# EAGLE design CUSTOMIZED UN0O BOARD (EAGLE 9.6.2)

## Sheet 1 of 2
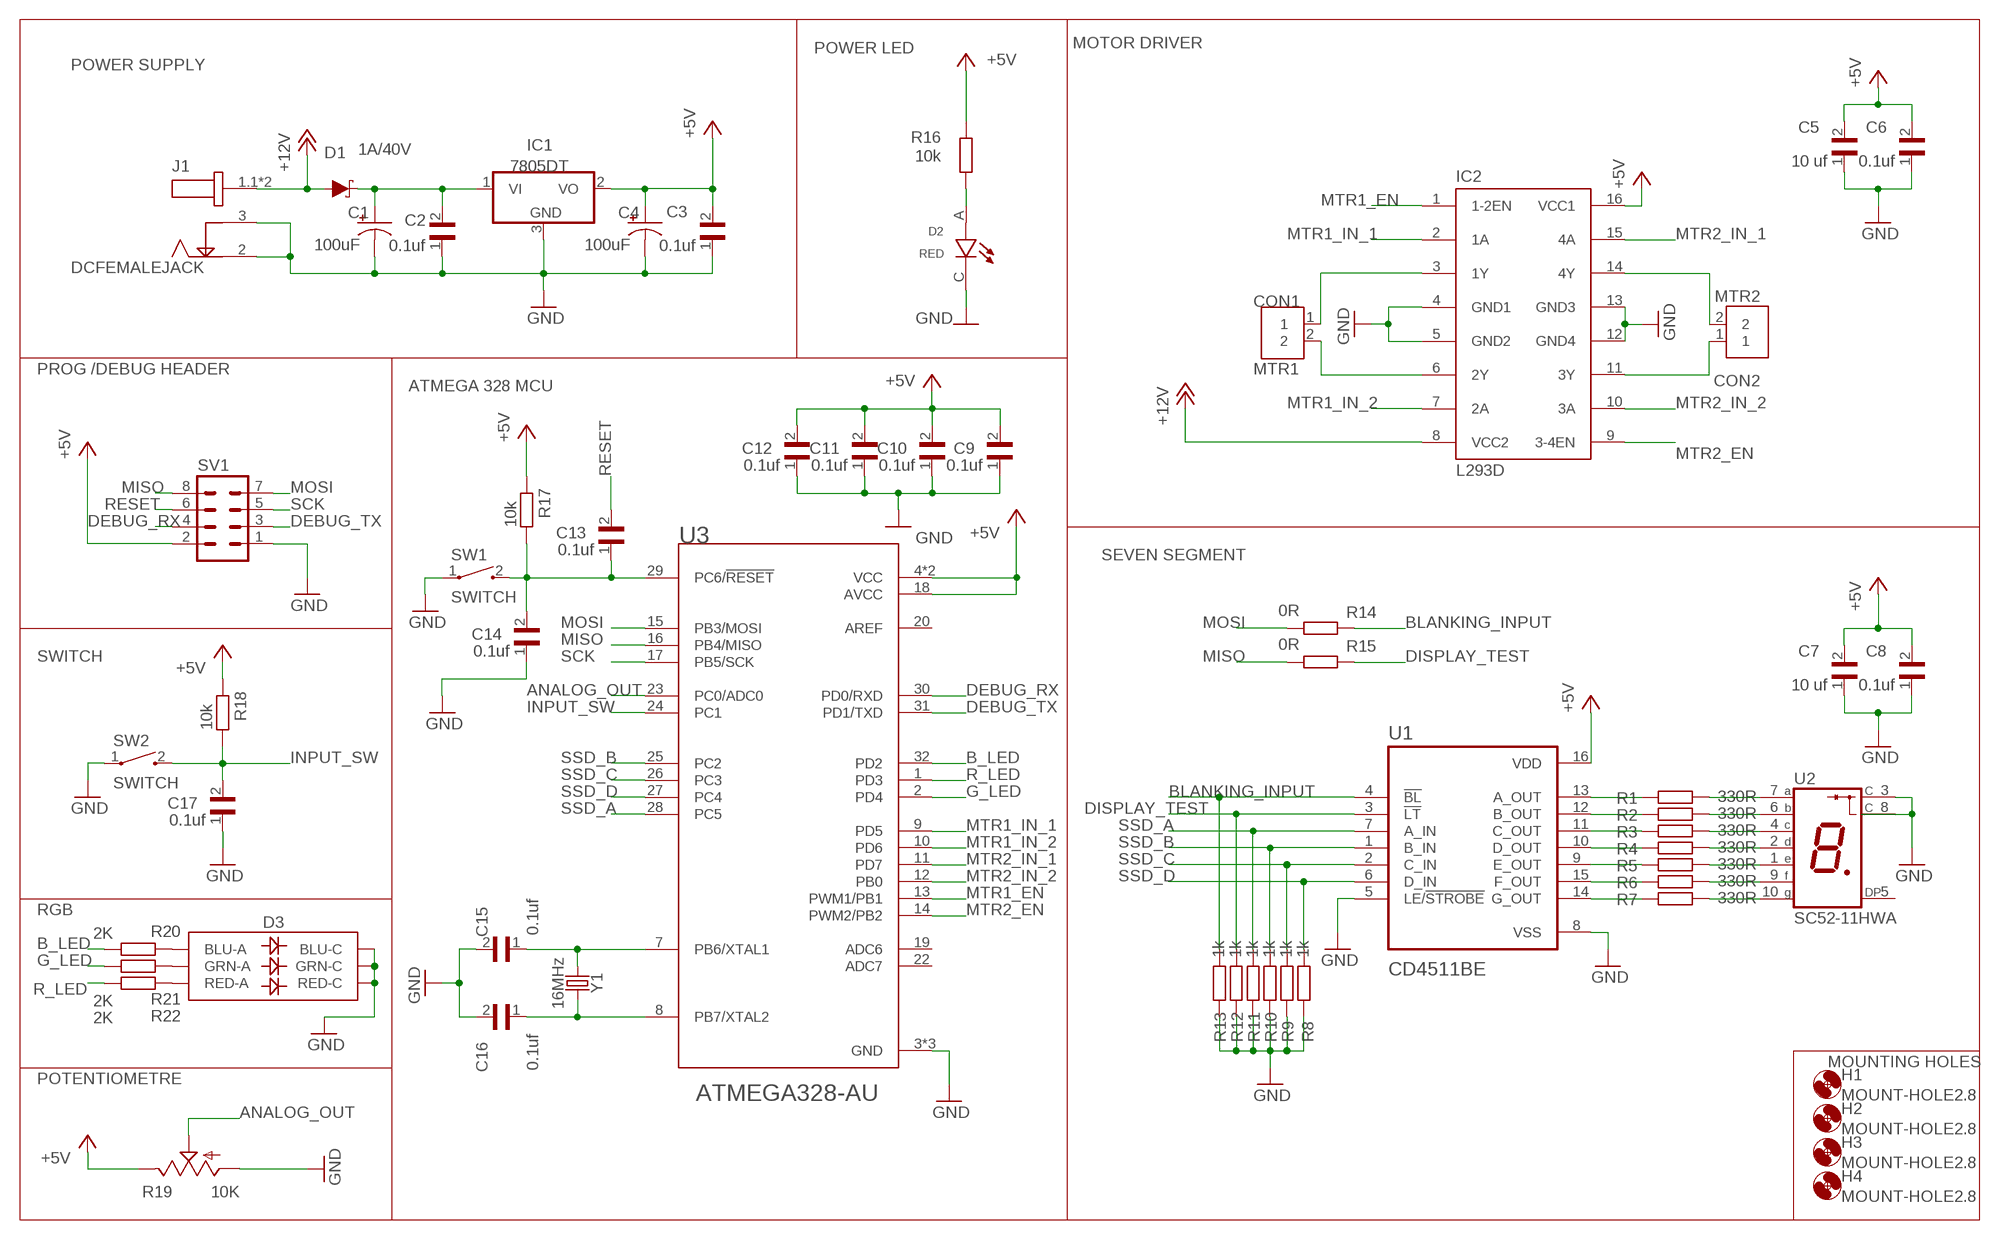
[diagram p0: schematic, sheet 1]

### Parts
C1  100uF  100UF-POLAR-RADIAL-2.5MM-25V-20%  [CPOL-RADIAL-2.5MM-6.5MM]
C2  CAPACITOR  [C0603]
C3  CAPACITOR  [C0603]
C4  100uF  100UF-POLAR-RADIAL-2.5MM-25V-20%  [CPOL-RADIAL-2.5MM-6.5MM]
C5  CAPACITOR  [C0603]
C6  CAPACITOR  [C0603]
C7  CAPACITOR  [C0603]
C8  CAPACITOR  [C0603]
C9  CAPACITOR  [C0603]
C10  CAPACITOR  [C0603]
C11  CAPACITOR  [C0603]
C12  CAPACITOR  [C0603]
C13  CAPACITOR  [C0603]
C14  CAPACITOR  [C0603]
C15  CAPACITOR  [C0603]
C16  22pf  CAPACITOR  [C0603]
C17  CAPACITOR  [C0603]
D1  3A/40V/500mV  DIODE-SCHOTTKY-B340A  [SMA-DIODE]
D2  RED  LTW-C191TLA  [LEDC1608X65N]
D3  LED-RGBNO_IC  [LED-TRICOLOR-5050]
H1  MOUNT-HOLE2.8  [2,8]
H2  MOUNT-HOLE2.8  [2,8]
H3  MOUNT-HOLE2.8  [2,8]
H4  MOUNT-HOLE2.8  [2,8]
IC1  7806DT  [TO252]
IC2  L293D  [DIL16]
J1  DCJ200-05-A-XX-X_REVA  [GCT_DCJ200-05-A-XX-X_REVA]
J2  282836-2  [CONN_282836-2]
J3  282836-2  [CONN_282836-2]
R1  330R  RESISTOR  [R0603]
R2  330R  RESISTOR  [R0603]
R3  330R  RESISTOR  [R0603]
R4  330R  RESISTOR  [R0603]
R5  330R  RESISTOR  [R0603]
R6  330R  RESISTOR  [R0603]
R7  330R  RESISTOR  [R0603]
R8  1k  RESISTOR  [R0603]
R9  1k  RESISTOR  [R0603]
R10  1k  RESISTOR  [R0603]
R11  1k  RESISTOR  [R0603]
R12  1k  RESISTOR  [R0603]
R13  1k  RESISTOR  [R0603]
R14  0R  RESISTOR  [R0603]
R15  0R  RESISTOR  [R0603]
R16  10k  RESISTOR  [R0603]
R17  10k  RESISTOR  [R0603]
R18  10k  RESISTOR  [R0603]
R19  10K  TRIM_US-S64W  [S64W]
R20  2K  RESISTOR  [R0603]
R21  2K  RESISTOR  [R0603]
R22  2K  RESISTOR  [R0603]
SV1  MA04-2  [MA04-2]
SW1  SWITCH  1437566-3  [SW_1437566-3]
SW2  SWITCH  1437566-3  [SW_1437566-3]
U1  CD4511BE  [DIP794W45P254L1969H508Q16]
U2  SC52-11HWA  [LED_SC52-11HWA]
U3  ATMEGA328-AU  [QFP80P900X900X120-32N]
Y1  16MHz  CRYSTAL-16MHZPTH-HC49US  [HC49US]

### Nets
+5V: C3.2 C4.1(+) C5.2 C6.2 C7.2 C8.2 C9.2 C10.2 C11.2 C12.2 IC1.2(VO) IC2.16(VCC1) R16.2 R17.2 R18.2 R19.E SV1.2 U1.16(VDD) U3.4(VCC) U3.6(VCC) U3.18(AVCC)
+12V: D1.A IC2.8(VCC2) J1.1.1 J1.1.2
ANALOG_OUT: R19.S U3.23(PC0/ADC0)
B_LED: R20.2 U3.32(PD2)
BLANKING_INPUT: R13.2 R14.2 U1.4(!BL)
DEBUG_RX: SV1.4 U3.30(PD0/RXD)
DEBUG_TX: SV1.3 U3.31(PD1/TXD)
DISPLAY_TEST: R12.2 R15.2 U1.3(!LT)
G_LED: R21.2 U3.2(PD4)
GND: C1.2(-) C2.1 C3.1 C4.2(-) C5.1 C6.1 C7.1 C8.1 C9.1 C10.1 C11.1 C12.1 C14.1 C15.2 C16.2 C17.1 D2.C D3.4(BLU-C) D3.5(RED-C) D3.6(GRN-C) IC1.3(GND) IC2.4(GND1) IC2.5(GND2) IC2.12(GND4) IC2.13(GND3) J1.2 J1.3 R8.1 R9.1 R10.1 R11.1 R12.1 R13.1 R19.A SV1.1 SW1.1 SW2.1 U1.5(LE/!STROBE) U1.8(VSS) U2.3(C) U2.8(C) U3.3(GND) U3.5(GND) U3.21(GND)
INPUT_SW: C17.2 R18.1 SW2.2 U3.24(PC1)
MISO: R15.1 SV1.8 U3.16(PB4/MISO)
MOSI: R14.1 SV1.7 U3.15(PB3/MOSI)
MTR1_EN: IC2.1(1-2EN) U3.13(PWM1/PB1)
MTR1_IN_1: IC2.2(1A) U3.9(PD5)
MTR1_IN_2: IC2.7(2A) U3.10(PD6)
MTR2_EN: IC2.9(3-4EN) U3.14(PWM2/PB2)
MTR2_IN_1: IC2.15(4A) U3.11(PD7)
MTR2_IN_2: IC2.10(3A) U3.12(PB0)
N$1: D2.A R16.1
N$2: IC2.6(2Y) J2.2
N$3: C1.1(+) C2.2 D1.C IC1.1(VI)
N$4: IC2.3(1Y) J2.1
N$5: IC2.14(4Y) J3.2
N$6: IC2.11(3Y) J3.1
N$7: R5.1 U1.9(E_OUT)
N$8: D3.3(BLU-A) R20.1
N$9: D3.1(GRN-A) R21.1
N$10: R5.2 U2.1(E)
N$11: R1.1 U1.13(A_OUT)
N$12: D3.2(RED-A) R22.1
N$14: R2.1 U1.12(B_OUT)
N$15: R3.1 U1.11(C_OUT)
N$16: R4.1 U1.10(D_OUT)
N$17: R6.1 U1.15(F_OUT)
N$18: R7.1 U1.14(G_OUT)
N$20: C13.1 C14.2 R17.1 SW1.2 U3.29(PC6/!RESET)
N$21: R1.2 U2.7(A)
N$22: R2.2 U2.6(B)
N$23: R3.2 U2.4(C)
N$24: R4.2 U2.2(D)
N$25: R6.2 U2.9(F)
N$26: R7.2 U2.10(G)
N$27: C15.1 U3.7(PB6/XTAL1) Y1.1
N$28: C16.1 U3.8(PB7/XTAL2) Y1.2
R_LED: R22.2 U3.1(PD3)
RESET: C13.2 SV1.6
SCK: SV1.5 U3.17(PB5/SCK)
SSD_A: R11.2 U1.7(A_IN) U3.28(PC5)
SSD_B: R10.2 U1.1(B_IN) U3.25(PC2)
SSD_C: R9.2 U1.2(C_IN) U3.26(PC3)
SSD_D: R8.2 U1.6(D_IN) U3.27(PC4)
Unconnected: U2.5(DP) U3.19(ADC6) U3.20(AREF) U3.22(ADC7)

### Notes on the sheet
- MOTOR DRIVER
- POWER LED
- POWER SUPPLY
- PROG /DEBUG HEADER
- ATMEGA 328 MCU
- SEVEN SEGMENT
- SWITCH
- RGB
- MOUNTING HOLES
- POTENTIOMETRE

## Sheet 2 of 2

## Library data of the parts
C1 C4 = SparkFun-Capacitors:100UF-POLAR: 100µF polarized capacitors A capacitor is a passive two-terminal electrical component used to store electrical energy temporarily in an electric field.; PROD_ID: CAP-08439
C2 = PC_Capacitor_0603:CAPACITOR: CAP CERAMIC, 0.1UF, 50V, X7R, 0603, FULL REEL Check prices <https://pricing.snapeda.com/parts/CGA3E2X7R1H104K080AA/TDK/view-part?ref=eda>; AVAILABILITY: Good; C2: 0.1uf; DESCRIPTION: 0.1µF ±10% 50V Ceramic Capacitor X7R 0603 (1608 Metric); MF: TDK; MP: CGA3E2X7R1H104K080AA; NULL: 0.1uf; PACKAGE: 1608 TDK; PRICE: None; PURCHASE-URL: https://pricing.snapeda.com/search/part/CGA3E2X7R1H104K080AA/?ref=eda
C3 C6 C8 C10-C17 = PC_Capacitor_0603:CAPACITOR: CAP CERAMIC, 0.1UF, 50V, X7R, 0603, FULL REEL Check prices <https://pricing.snapeda.com/parts/CGA3E2X7R1H104K080AA/TDK/view-part?ref=eda>; AVAILABILITY: Good; DESCRIPTION: 0.1µF ±10% 50V Ceramic Capacitor X7R 0603 (1608 Metric); MF: TDK; MP: CGA3E2X7R1H104K080AA; NULL: 0.1uf; PACKAGE: 1608 TDK; PRICE: None; PURCHASE-URL: https://pricing.snapeda.com/search/part/CGA3E2X7R1H104K080AA/?ref=eda
C5 C7 = PC_Capacitor_0603:CAPACITOR: CAP CERAMIC, 0.1UF, 50V, X7R, 0603, FULL REEL Check prices <https://pricing.snapeda.com/parts/CGA3E2X7R1H104K080AA/TDK/view-part?ref=eda>; AVAILABILITY: Good; C3: 10 uf; DESCRIPTION: 0.1µF ±10% 50V Ceramic Capacitor X7R 0603 (1608 Metric); MF: TDK; MP: CGA3E2X7R1H104K080AA; NO: 10; NULL: 0.1uf; PACKAGE: 1608 TDK; PRICE: None; PURCHASE-URL: https://pricing.snapeda.com/search/part/CGA3E2X7R1H104K080AA/?ref=eda
C9 = PC_Capacitor_0603:CAPACITOR: CAP CERAMIC, 0.1UF, 50V, X7R, 0603, FULL REEL Check prices <https://pricing.snapeda.com/parts/CGA3E2X7R1H104K080AA/TDK/view-part?ref=eda>; AVAILABILITY: Good; C9: 22pf; DESCRIPTION: 0.1µF ±10% 50V Ceramic Capacitor X7R 0603 (1608 Metric); MF: TDK; MP: CGA3E2X7R1H104K080AA; NULL: 0.1uf; PACKAGE: 1608 TDK; PRICE: None; PURCHASE-URL: https://pricing.snapeda.com/search/part/CGA3E2X7R1H104K080AA/?ref=eda
D1 = SparkFun-DiscreteSemi:DIODE-SCHOTTKY: Schottky diode A Schottky diode is a semiconductor diode which has a low forward voltage drop and a very fast switching action.; D1: 1A,40V; NULL: 1A/40V; PROD_ID: DIO-09886
D2 = PC_LED_0603:LTW-C191TLA: CHIP LED WHITE 0603 TOP VIEW Check prices <https://pricing.snapeda.com/parts/LTW-C191TLA/Lite-On/view-part?ref=eda>; AVAILABILITY: Warning; DESCRIPTION: White LED Indication - Discrete 3.1V 0603 (1608 Metric); MF: Lite-On; MP: LTW-C191TLA; PACKAGE: 0603 Lite-On; PRICE: None; PURCHASE-URL: https://pricing.snapeda.com/search/part/LTW-C191TLA/?ref=eda
D3 = SparkFun-LED:LED-RGB: LED-RGB 6 pin RGB LED (no common connector) Packages: PLCC-6 LED-TRICOLOR-5050 - No built-in IC SparkFun Products: Digital Sandbox <https://www.sparkfun.com/products/12651> LED- SMD RGB <https://www.sparkfun.com/products/10866>; PROD_ID: DIO-10298
H1-H4 = holes:MOUNT-HOLE: MOUNTING HOLE with drill center marker
IC1 = linear:78*: Positive VOLTAGE REGULATOR Source: http://cache.national.com/ds/LM/LM78L05.pdf http://www.fairchildsemi.com/ds/LM/LM7805.pdf; K: 7805DT
IC2 = st-microelectronics:L293D: PUSH-PULL 4 CHANNEL DRIVER; MPN: L293D; OC_FARNELL: 9589619; OC_NEWARK: 56P8249
J1 = PC_CON_DC_Power_Jack:DCJ200-05-A-XX-X_REVA: DC Power Jack, SMT, Horizontal, with Locating Pegs, D2.0mm Check prices <https://pricing.snapeda.com/parts/DCJ200-05-A-K1-A/Global%20Connector%20Technology/view-part?ref=eda>; AVAILABILITY: Warning; DESCRIPTION: Power Barrel Connector Jack 2.05mm ID (0.081), 5.50mm OD (0.217) Surface Mount, Right Angle; MF: Global Connector Technology; MP: DCJ200-05-A-K1-A; PACKAGE: None; PRICE: None; PURCHASE-URL: https://pricing.snapeda.com/search/part/DCJ200-05-A-K1-A/?ref=eda
J2 J3 = PC_Con_ScrewTerminal_2P_5mm:282836-2: TERM BLOCK 2POS SIDE ENTRY 5MM Check availability <https://pricing.snapeda.com/parts/282836-2/TE%20Connectivity/view-part?ref=eda>; AVAILABILITY: In Stock; COMMENT: 282836-2; DESCRIPTION: Connector, Terminal Block; Wire Receptacle; 2 Pos.; 16-30 AWG; 0.197 in. CL; Sid; MF: TE Connectivity; MP: 282836-2; PACKAGE: None; PRICE: None; PURCHASE-URL: https://pricing.snapeda.com/search/part/282836-2/?ref=eda
R1-R18 R20-R22 = PC_Resistor_0603:RESISTOR; MF: Yageo; RESISTOR: 0603
R19 = pot:TRIM_US-: POTENTIOMETER
SV1 = con-lstb:MA04-2: PIN HEADER; OC_FARNELL: unknown; OC_NEWARK: unknown
SW1 SW2 = PC_Switch_1437566-3:1437566-3: Switch Tactile OFF (ON) SPST Rectangular Button Gull Wing 0.05A 12VDC SMD Loose Piece Check prices <https://pricing.snapeda.com/parts/1437566-3/TE%20Connectivity/view-part?ref=eda>; AVAILABILITY: Good; COMMENT: 1437566-3; CONFIGURATION_POLE-THROW: Single Pole - Single Throw; CONTACT_CURRENT_RATING: 50 mA; DESCRIPTION: Tactile Switch SPST-NO Top Actuated Surface Mount; MF: TE Connectivity; MP: 1437566-3; PACKAGE: None; PRICE: None
U1 = PC_IC_CD4511BE:CD4511BE: None Check availability <https://pricing.snapeda.com/parts/CD4511BE/Texas%20Instruments/view-part?ref=eda>; AVAILABILITY: In Stock; DESCRIPTION: CMOS BCD-to-7-Segment LED Latch Decoder Drivers 16-PDIP -55 to 125; MF: Texas Instruments; MP: CD4511BE; PACKAGE: PDIP-16 Texas Instruments; PRICE: None; PURCHASE-URL: https://pricing.snapeda.com/search/part/CD4511BE/?ref=eda
U2 = PC_LED-7-SegmentDisplay:SC52-11HWA: Display: LED; single 7-segment; 13.2mm; red; 0.9-2.2mcd Check availability <https://pricing.snapeda.com/parts/SC52-11HWA/Kingbright/view-part?ref=eda>; AVAILABILITY: Not in stock; DESCRIPTION: Display: LED; single 7-segment; 13.2mm; red; 0.9-2.2mcd; MF: Kingbright; MP: SC52-11HWA; PACKAGE: None; PRICE: None
U3 = PC_IC_ATMEGA328-AU:ATMEGA328-AU: ATmega Series 20 MHz 32 KB Flash 2 KB SRAM 8-Bit Microcontroller - TQFP-32 Check prices <https://pricing.snapeda.com/parts/ATMEGA328-AU/Microchip/view-part?ref=eda>; AVAILABILITY: In Stock; DESCRIPTION: AVR AVR® ATmega Microcontroller IC 8-Bit 20MHz 32KB (16K x 16) FLASH 32-TQFP (7x7); MF: Microchip; MP: ATMEGA328-AU; PACKAGE: TQFP-32 Microchip; PRICE: None; PURCHASE-URL: https://pricing.snapeda.com/search/part/ATMEGA328-AU/?ref=eda
Y1 = SparkFun-Clocks:CRYSTAL-16MHZ: 16MHz Crystal Digikey Example <http://www.digikey.com/product-search/en?keywords=535-9122-1-ND> Frequency: 16MHz Frequency Stability: ±50ppm Frequency Tolerance: ±20ppm Load Capacitance: 18pF SparkFun Products: Pro Micro -5V/16MHz <https://www.sparkfun.com/products/12640> SparkFun Serial Enabled LCD Kit <https://www.sparkfun.com/products/10097>; PROD_ID: XTAL-08181; SF_ID: COM-00536

## Board
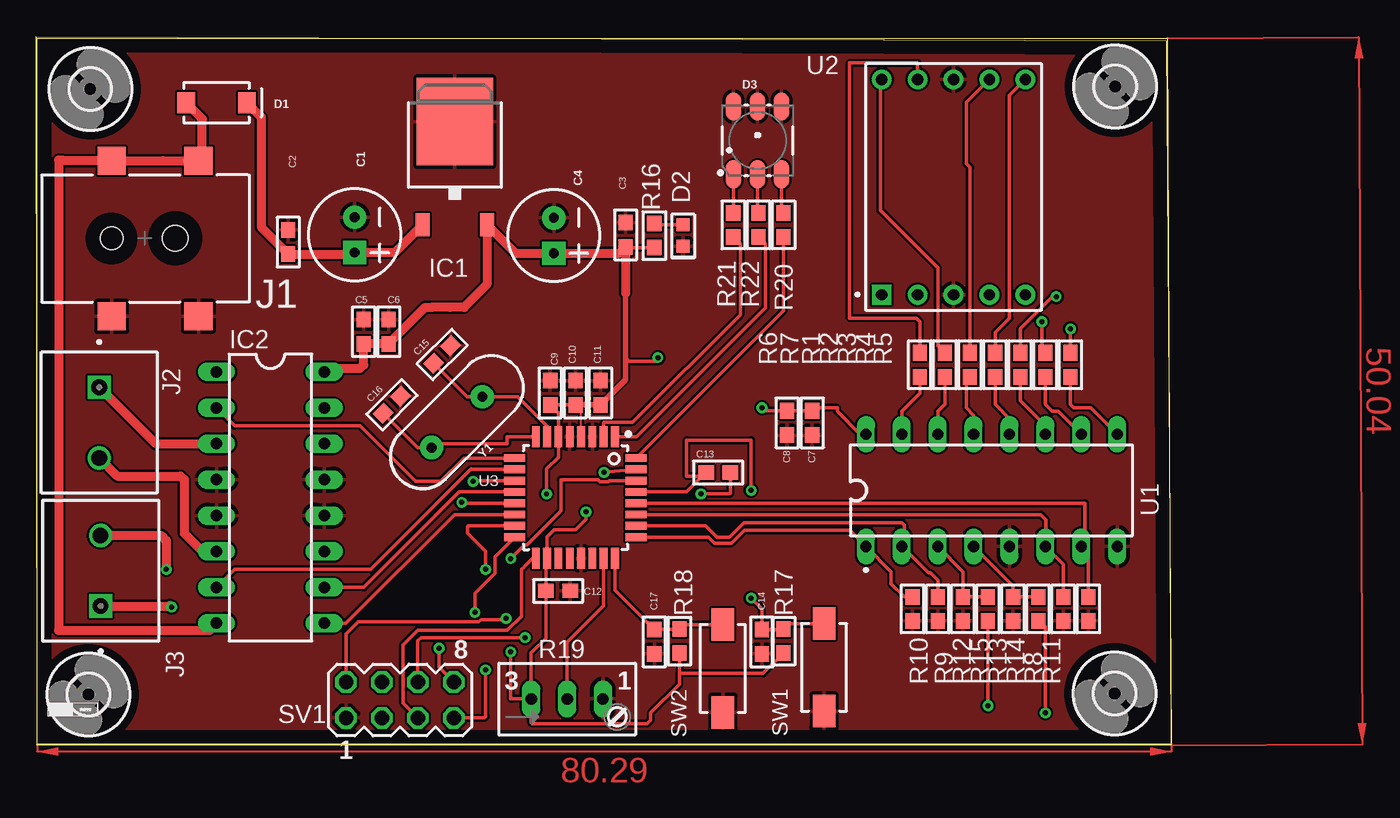
[diagram p1: board, top side]
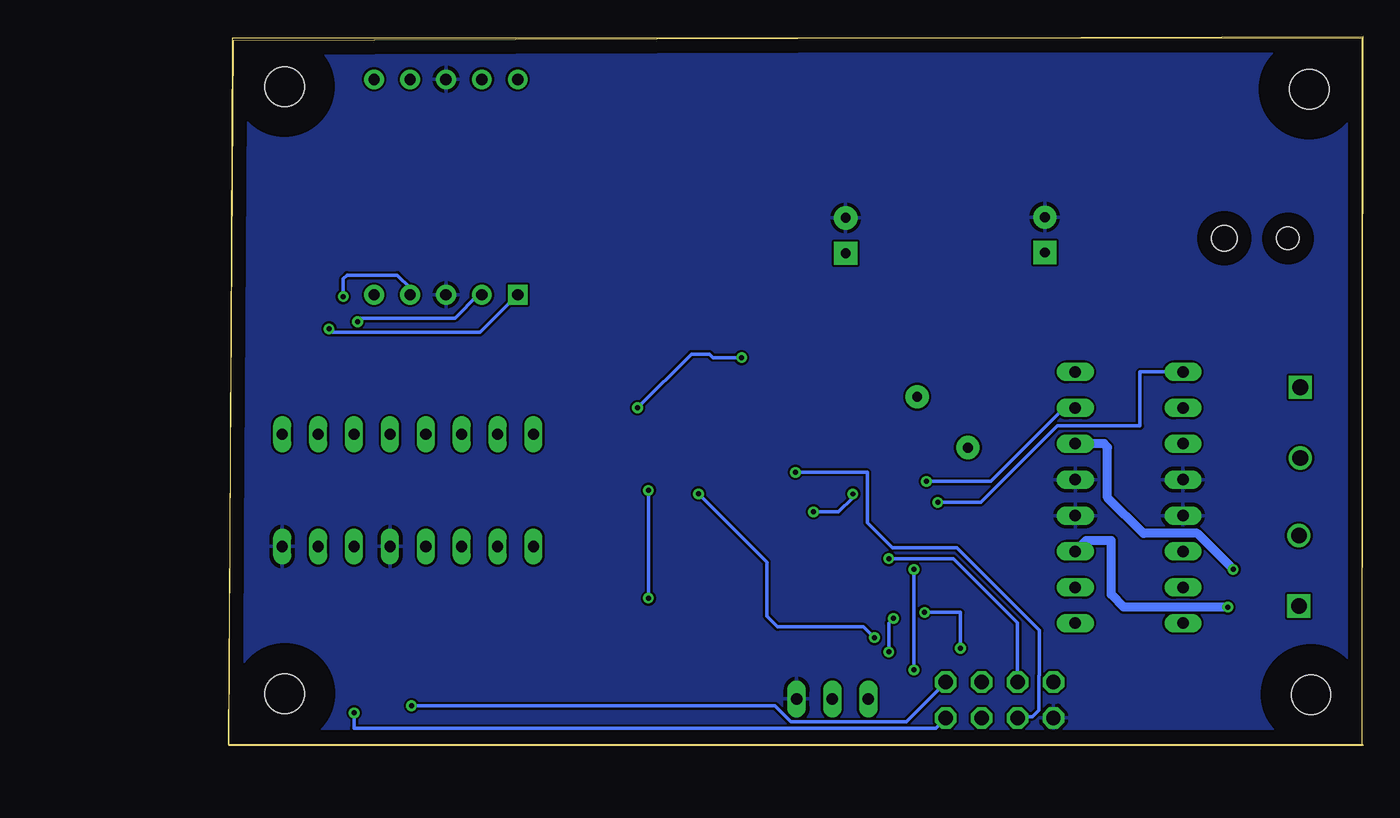
[diagram p2: board, bottom side, seen from below]

Size 80.37 x 50.14 mm. Coordinates in mm from the lower left corner, seen from the top.
Outline: 0.08,0 0,50.14 80.01,49.86 80.37,0.08 0.08,0.08 0,0
Outline: 0.08,0 0.08,50.04 80.09,50.04 80.34,0 0.08,0
Copper layers (1*16): Top 0.035mm / dielectric 1.5mm / Bottom 0.035mm
Design rules "default": minimum track width 6mil, minimum drill 0.35mm, track to track 6mil, track to pad 6mil, pad to pad 6mil, via to via 6mil, smd to smd 6mil, copper to edge 40mil, drill to drill 6mil, minimum pad ring 10mil, minimum via ring 8mil, stop-mask expansion 4mil, vias tented up to drill 0mil, thermal gap 10mil

### Footprints (pad centres in the part's own frame; a part is rotated, then mirrored left to right if it is on the bottom)
CPOL-RADIAL-2.5MM-6.5MM = drill 0.7 pad 1.651 square: 1 1.25,0 | drill 0.7 pad 1.651: 2 -1.25,0
C0603 = smd 1.1 x 1: 1 -0.909,0; 2 0.809,0
SMA-DIODE = smd 1.27 x 1.47: A -2.15,0; C 2.15,0
LEDC1608X65N = smd 0.91 x 0.93: A 0.76,0; C -0.76,0
LED-TRICOLOR-5050 = smd 2 x 1.1: 1 -2.4,1.7; 2 -2.4,0; 3 -2.4,-1.7; 4 2.4,-1.7; 5 2.4,0; 6 2.4,1.7
2,8 = hole 2.8: 0,0
TO252 = smd 1 x 1.6: 1 -2.28,-4.8; 2 2.28,-4.8 | smd 5.4 x 6.2: 3 0,2.5
DIL16 = drill 0.813 long: 1 -8.89,-3.81; 2 -6.35,-3.81; 3 -3.81,-3.81; 4 -1.27,-3.81; 5 1.27,-3.81; 6 3.81,-3.81; 7 6.35,-3.81; 8 8.89,-3.81; 9 8.89,3.81; 10 6.35,3.81; 11 3.81,3.81; 12 1.27,3.81; 13 -1.27,3.81; 14 -3.81,3.81; 15 -6.35,3.81; 16 -8.89,3.81
GCT_DCJ200-05-A-XX-X_REVA = smd 2 x 2: 1.1 -5.5,3.8; 1.2 -5.5,-2.35; 2 5.5,-2.35; 3 5.5,3.8 | hole 1.8: 0,2.15 | hole 1.6: 0,-2.35
CONN_282836-2 = drill 1.1 square: 1 -2.5,0 | drill 1.1: 2 2.5,0
R0603 = smd 1.1 x 1: 1 -0.85,0; 2 0.85,0
S64W = drill 0.813 long: A 2.54,1.27; E -2.54,1.27; S 0,1.27
MA04-2 = drill 1.016 octagon: 1 -3.81,-1.27; 2 -3.81,1.27; 3 -1.27,-1.27; 4 -1.27,1.27; 5 1.27,-1.27; 6 1.27,1.27; 7 3.81,-1.27; 8 3.81,1.27
SW_1437566-3 = smd 2.3 x 1.6: 1 -3.08,0; 2 3.12,0
DIP794W45P254L1969H508Q16 = drill 0.78 pad 1.13 long: 1 -3.97,8.89; 2 -3.97,6.35; 3 -3.97,3.81; 4 -3.97,1.27; 5 -3.97,-1.27; 6 -3.97,-3.81; 7 -3.97,-6.35; 8 -3.97,-8.89; 9 3.97,-8.89; 10 3.97,-6.35; 11 3.97,-3.81; 12 3.97,-1.27; 13 3.97,1.27; 14 3.97,3.81; 15 3.97,6.35; 16 3.97,8.89
LED_SC52-11HWA = drill 0.8 pad 1.4 square: 1 -7.62,5.08 | drill 0.8 pad 1.4: 2 -7.62,2.54; 3 -7.62,0; 4 -7.62,-2.54; 5 -7.62,-5.08; 6 7.62,-5.08; 7 7.62,-2.54; 8 7.62,0; 9 7.62,2.54; 10 7.62,5.08
QFP80P900X900X120-32N = smd 1.5 x 0.55: 1 -4.3,2.8; 2 -4.3,2; 3 -4.3,1.2; 4 -4.3,0.4; 5 -4.3,-0.4; 6 -4.3,-1.2; 7 -4.3,-2; 8 -4.3,-2.8; 17 4.3,-2.8; 18 4.3,-2; 19 4.3,-1.2; 20 4.3,-0.4; 21 4.3,0.4; 22 4.3,1.2; 23 4.3,2; 24 4.3,2.8 | smd 0.55 x 1.5: 9 -2.8,-4.3; 10 -2,-4.3; 11 -1.2,-4.3; 12 -0.4,-4.3; 13 0.4,-4.3; 14 1.2,-4.3; 15 2,-4.3; 16 2.8,-4.3; 25 2.8,4.3; 26 2,4.3; 27 1.2,4.3; 28 0.4,4.3; 29 -0.4,4.3; 30 -1.2,4.3; 31 -2,4.3; 32 -2.8,4.3
HC49US = drill 0.7 pad 1.651: 1 -2.54,0; 2 2.54,0

### Placement (x,y rotation side)
C1  22.56,36.12 270 top
C2  17.86,35.56 270 top
C3  41.73,36.07 270 top
C4  36.65,36.07 270 top
C5  23.19,29.21 270 top
C6  24.97,29.21 270 top
C7  54.94,22.86 90 top
C8  53.16,22.86 90 top
C9  36.4,24.89 270 top
C10  38.18,24.89 270 top
C11  39.95,24.89 270 top
C12  36.91,10.92 180 top
C13  48.34,19.3 0 top
C14  51.38,7.37 90 top
C15  28.78,27.69 45 top
C16  25.22,24.13 45 top
C17  43.76,7.37 90 top
D1  12.78,45.47 0 top
D2  45.8,36.07 90 top
D3  51.08,42.8 90 top
H1  3.84,46.43 0 top
H2  76.38,46.61 0 top
H3  3.71,3.58 0 top
H4  76.35,3.66 0 top
IC1  29.64,41.63 0 top
IC2  16.59,17.53 270 top
J1  7.7,35.86 270 top
J2  4.47,22.83 270 top
J3  4.57,12.34 90 top
R1  66.12,26.92 90 top
R2  67.89,26.92 90 top
R3  69.67,26.92 90 top
R4  71.45,26.92 90 top
R5  73.23,26.92 90 top
R6  62.56,26.92 90 top
R7  64.34,26.92 90 top
R8  72.72,9.65 90 top
R9  63.83,9.65 90 top
R10  62.05,9.65 90 top
R11  74.5,9.65 90 top
R12  65.61,9.65 90 top
R13  69.16,9.65 90 top
R14  70.94,9.65 90 top
R15  67.39,9.65 90 top
R16  43.76,36.07 270 top
R17  52.91,7.37 270 top
R18  45.54,7.37 270 top
R19  37.59,2.01 0 top
R20  52.91,36.83 270 top
R21  49.35,36.83 270 top
R22  51.13,36.83 270 top
SV1  25.76,3.2 0 top
SW1  55.78,5.49 90 top
SW2  48.62,5.41 90 top
U1  67.64,18.03 90 top
U2  64.95,39.5 90 top
U3  38.18,17.53 270 top
Y1  29.79,22.86 225 top

### Tracks (layer width: path | path; a pad name or v marks a point on that pad's centre or on a via)
+5V  (via drill 0.35)
  Top 0.152: U3.4 38.58,24.08 38.38,24.08
  Top 0.254: C3.2 41.77,35.22 R16.2 | C9.2 36.5,23.98 | 36.5,23.98 36.98,23.5 U3.6 36.98,20.39 36.14,19.56 v36.14,17.78 | 38.38,24.08 38.28,23.98 C10.2 36.61,24.08 36.5,23.98 | U1.16 58.34,22 56.72,23.62 56.72,23.88 55.15,23.88 C7.2 C8.2 51.59,23.67 v51.38,23.88 | 41.73,27.43 41.99,27.18 44.02,27.18 v44.02,27.43 | R18.2 45.54,5.08 | 45.54,5.08 45.54,4.32 43.51,2.29 43.51,1.78 43.26,1.52 35.13,1.52 35.05,1.6 R19.E | R19.E 33.63,3.28 33.6,3.3 v33.6,6.6 33.6,6.86 | SV1.2 21.95,7.9 22.79,8.74 31.34,8.74 31.49,8.89 33.18,8.89 v33.27,8.97 | R19.E 35.05,6.53 36.1,7.57 C12.2 36.1,13.15 U3.18 36.18,14.76 36.65,15.24 38.18,15.24 38.94,16 v38.94,16.51 | R17.2 51.47,5.08 45.54,5.08
  Top 0.381: 41.73,32 41.73,27.43 41.73,25.86 C11.2 38.38,24.08
  Top 0.635: 41.73,32 C3.2 41.29,34.82 C4.1 33.93,34.82 IC1.2 31.92,32.61 30.3,30.99 29.29,30.99 28.02,30.99 27.56,30.99 C6.2 C5.2 23.19,26.92 22.94,26.67 20.65,26.67 IC2.16
  Bottom 0.254: v44.02,27.43 46.05,27.43 46.3,27.69 47.57,27.69 v51.38,23.88 | v33.27,8.97 33.6,8.64 v33.6,6.6 | v38.94,16.51 37.16,16.51 36.14,17.53 v36.14,17.78
+12V
  Top 0.254: J1.1.1 8.97,41.37
  Top 0.635: D1.A 11.76,44.33 11.76,41.91 11,41.15 10.78,41.37 8.97,41.37 J1.1.2 1.89,41.37 1.85,41.4 1.6,41.4 1.6,8.13 12.27,8.13 IC2.8
ANALOG_OUT
  Top 0.254: R19.S 37.59,7.29 40.18,9.87 U3.23
B_LED
  Top 0.254: U3.32 52.91,30.76 R20.2
BLANKING_INPUT
  Top 0.254: U1.4 69.16,11.27 R13.2 R14.2
DEBUG_RX  (via drill 0.35)
  Top 0.254: U3.30 40.56,18.73 40.48,18.65 39.94,18.65 39.79,18.8 37.16,18.8 37.16,16.59 34.74,14.17 34.57,14.17 v33.6,13.21
  Bottom 0.254: v33.6,13.21 29.03,13.21 24.49,8.66 SV1.4
DEBUG_TX  (via drill 0.35)
  Top 0.254: U3.31 v40.21,19.3
  Bottom 0.254: SV1.3 24.38,2.03 23.44,2.03 22.99,2.49 22.99,4.9 22.94,4.95 22.94,8.13 28.78,13.97 33.35,13.97 35.13,15.75 35.13,19.3 v40.21,19.3
DISPLAY_TEST
  Top 0.254: U1.3 65.61,12.29 R12.2 R15.2
G_LED
  Top 0.254: U3.2 40.18,22.83 40.21,22.86 42.24,22.86 49.86,30.48 49.86,35.47 R21.2
GND
  pour Top: -2.46,50.8 -2.46,0 -1.19,-1.27 81.36,-1.27 82.63,0 82.63,49.53 81.36,50.8
  pour Bottom: -1.19,50.8 -1.19,-1.27 82.63,-1.27 82.63,50.8
INPUT_SW
  Top 0.254: SW2.2 45.86,8.53 R18.1 43.81,8.22 C17.2 40.98,10.96 U3.24
MISO  (via drill 0.35)
  Top 0.254: SV1.8 28.52,5.51 v28.52,6.86 | R15.1 v67.39,2.79 | U3.16 32.48,13.33 32.48,12.17 31.06,10.75 v31.06,9.4
  Bottom 0.254: v28.52,6.86 28.52,9.4 v31.06,9.4 | v67.39,2.79 41.64,2.79 40.52,1.68 32.36,1.68 SV1.8
MOSI  (via drill 0.35)
  Top 0.254: SV1.7 31.72,1.93 31.83,2.03 v31.83,5.33 | v31.83,12.45 31.83,13.72 30.56,14.99 30.56,15.49 30.59,15.53 U3.15 | 71.45,8.38 71.03,8.8 R14.1 71.45,8.29 v71.45,2.29
  Bottom 0.254: v31.83,5.33 v31.83,12.45 | v71.45,2.29 71.45,1.22 30.28,1.22 SV1.7
MTR1_EN  (via drill 0.35)
  Top 0.254: U3.13 30.19,17.13 v30.13,17.19 30.05,17.27
  Bottom 0.254: v30.13,17.19 27.08,17.19 21.67,22.61 15.82,22.61 15.82,26.42 IC2.1
MTR1_IN_1
  Top 0.254: U3.9 30.3,20.33 30.3,20.32 28.65,18.67 26.87,18.67 22.94,22.61 14.05,22.61 IC2.2
MTR1_IN_2
  Top 0.254: U3.10 30.84,19.53 30.81,19.56 23.7,12.45 14.05,12.45 IC2.7
MTR2_EN
  Top 0.254: U3.14 29.61,16.33 21.92,8.64 IC2.9
MTR2_IN_1  (via drill 0.35)
  Top 0.254: U3.11 31.13,18.73 31.06,18.8 v30.94,18.67
  Bottom 0.254: v30.94,18.67 26.37,18.67 21.16,23.88 IC2.15
MTR2_IN_2
  Top 0.254: U3.12 29.94,17.93 23.19,11.18 IC2.10
N$1
  Top 0.254: D2.A 43.85,36.83 R16.1
N$2
  Top 0.635: J2.2 5.76,19.05 10.24,19.05 10.49,18.8 10.49,14.99 11.76,13.72 IC2.6
N$3
  Top 0.635: D1.C 15.94,44.45 15.94,36.66 C2.2 22.44,34.75 C1.1 25.4,34.87 IC1.1
N$4
  Top 0.635: J2.1 8.47,21.34 IC2.3
N$5  (via drill 0.35)
  Top 0.635: J3.2 8.85,14.84 9.22,14.48 v9.22,12.45
  Bottom 0.635: v9.22,12.45 11.76,14.99 15.57,14.99 18.11,17.53 18.11,21.08 18.36,21.34 IC2.14
N$6  (via drill 0.35)
  Top 0.635: J3.1 9.41,9.84 9.47,9.91 v9.6,9.78
  Bottom 0.635: v9.6,9.78 16.97,9.78 17.86,10.67 17.86,14.48 19.63,14.48 IC2.11
N$7
  Top 0.254: U1.9 74.66,23.88 73.48,23.88 73.23,24.13 R5.1
N$8
  Top 0.254: D3.3 52.78,37.81 R20.1
N$9
  Top 0.254: D3.1 49.38,37.71 R21.1
N$10  (via drill 0.35)
  Top 0.254: R5.2 v73.23,29.46
  Bottom 0.254: v73.23,29.46 72.97,29.21 62.54,29.21 U2.1
N$11
  Top 0.254: U1.13 66.37,23.37 65.86,23.88 65.86,25.82 R1.1
N$12
  Top 0.254: D3.2 51.08,37.73 R22.1
N$14
  Top 0.254: U1.12 68.91,23.11 67.89,24.13 R2.1
N$15
  Top 0.254: U1.11 71.45,22.61 69.67,24.38 R3.1
N$16
  Top 0.254: U1.10 72.37,23.62 71.96,23.62 71.45,24.13 R4.1
N$17
  Top 0.254: U1.15 61.29,23.62 62.56,24.89 R6.1
N$18
  Top 0.254: U1.14 63.83,23.62 64.34,24.13 R7.1
N$20  (via drill 0.35)
  Top 0.254: U3.29 46.05,17.93 C13.1 47.17,19.05 46.05,19.05 46.05,21.59 50.62,21.59 v50.62,18.03 | SW1.2 53.3,8.61 R17.1 52.82,8.13 52.77,8.18 C14.2 51.38,9.65 v50.62,10.41
  Top 0.635: C14.2 51.43,8.13
  Bottom 0.254: v50.62,18.03 v50.62,10.41
N$21
  Top 0.254: U2.7 65.86,45.49 65.86,41.15 66.12,40.89 R1.2
N$22
  Top 0.254: R2.2 67.89,29.21 68.91,30.23 68.91,46 U2.6
N$23  (via drill 0.35)
  Top 0.254: R3.2 69.67,29.46 71.96,31.75 v72.21,31.75
  Bottom 0.254: v72.21,31.75 72.21,33.02 71.96,33.27 68.4,33.27 67.49,32.36 U2.4
N$24  (via drill 0.35)
  Top 0.254: R4.2 71.2,28.03 v71.2,29.97
  Bottom 0.254: v71.2,29.97 71.2,30.23 64.31,30.23 62.66,31.88 U2.2
N$25
  Top 0.254: R6.2 62.56,29.97 62.31,30.23 57.58,30.23 57.58,48.3 62.41,48.3 U2.9
N$26
  Top 0.254: R7.2 63.83,28.28 63.83,33.78 59.77,37.85 59.77,47.02 U2.10
N$27
  Top 0.254: U3.7 36.18,22.57 34.09,24.66 Y1.1 30.52,24.66 C15.1
N$28
  Top 0.254: U3.8 35.36,21.84 33.35,21.84 33.35,21.34 28.27,21.34 Y1.2 27,21.06 C16.1
R_LED
  Top 0.254: U3.1 42.5,21.83 51.64,30.96 51.64,35.47 R22.2
RESET  (via drill 0.35)
  Top 0.254: SV1.6 27.03,7.39 27.25,7.62 v34.62,7.62 | C13.2 49.15,19.05 49.15,18.75 49.15,17.83 49.1,17.78 v47.07,17.78
  Bottom 0.254: v34.62,7.62 35.38,8.38 41.48,8.38 42.24,9.14 42.24,12.95 v47.07,17.78
SCK
  Top 0.254: SV1.5 25.98,2.97 25.98,7.11 27,8.13 33.35,8.13 34.37,9.14 34.37,12.45 34.49,12.57 34.62,12.7 35.15,13.23 U3.17
SSD_A
  Top 0.254: R11.2 74.5,13.56 U1.7 74.24,14.32 74.24,17.13 U3.28
SSD_B
  Top 0.254: R10.2 61.46,10.5 60.53,11.43 60.53,12.29 U1.1 57.61,15.21 50.15,15.21 49.24,14.3 48.02,14.3 47.6,14.73 U3.25
SSD_C
  Top 0.254: U1.2 61.46,13.89 | 61.46,13.89 63.16,12.19 63.32,12.19 63.83,11.68 R9.2 | U3.26 47.37,15.53 48.19,14.71 49.08,14.71 50.11,15.75 61.29,15.75 61.46,15.57 61.46,13.89
SSD_D
  Top 0.254: U1.6 71.5,14.02 | 71.5,14.02 72.72,12.79 R8.2 | U3.27 71.13,16.33 71.5,15.96 71.5,14.02
(copper drawn outside any net)
  shapes: Top area x2

### Text on the board
_tplace: 8 | 3 | 1 | 1